# Altium schematic sheet TFT LCD ER-TFT018-2.SchDoc
size A4
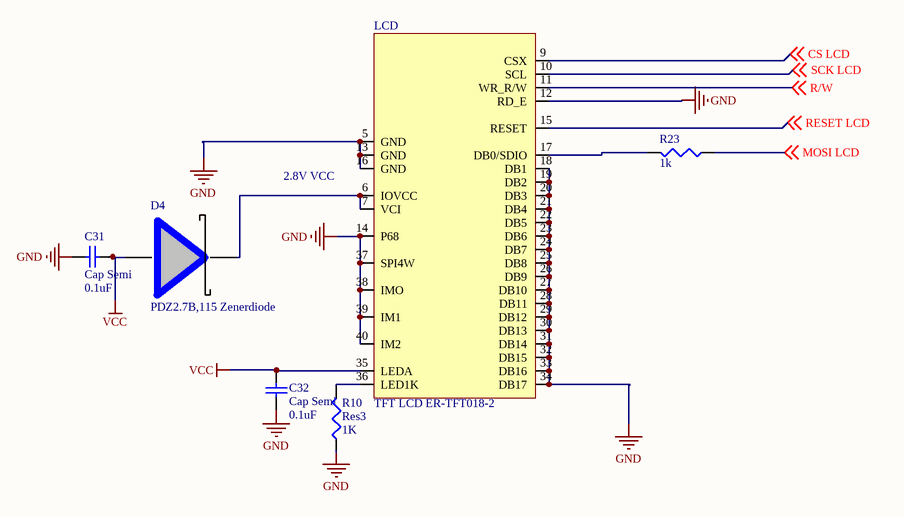
[diagram p0: TFT LCD ER-TFT018-2.SchDoc]

## Parts
C31  Cap Semi  value 0.1uF  [1608[0603]]
C32  Cap Semi  value 0.1uF  [1608[0603]]
D4  PDZ2.7B,115 Zenerdiode  [PDZ2.7B,115]
LCD  TFT LCD ER-TFT018-2  [LCD TFT Display]
R10  Res3  value 1K  [J1-0603]
R23  value 1k  [J1-0603]  (hidden comment: Res3)

## Nets
GND: C31.1 C32.1 LCD.5(GND) LCD.12(RD_E) LCD.13(GND) LCD.14(P68) LCD.16(GND) LCD.18(DB1) LCD.19(DB2) LCD.20(DB3) LCD.21(DB4) LCD.22(DB5) LCD.23(DB6) LCD.24(DB7) LCD.25(DB8) LCD.26(DB9) LCD.27(DB10) LCD.28(DB11) LCD.29(DB12) LCD.30(DB13) LCD.31(DB14) LCD.32(DB15) LCD.33(DB16) LCD.34(DB17) LCD.37(SPI4W) LCD.38(IMO) LCD.39(IM1) LCD.40(IM2) R10.1
VCC: C31.2 C32.2 D4.2 LCD.35(LEDA)
CS LCD: LCD.9(CSX) ; off-sheet CS LCD
MOSI LCD: R23.1 ; off-sheet MOSI LCD
R/W: LCD.11(WR_R/W) ; off-sheet R/W
RESET LCD: LCD.15(RESET) ; off-sheet RESET LCD
SCK LCD: LCD.10(SCL) ; off-sheet SCK LCD
NetD4_1: D4.1 LCD.6(IOVCC) LCD.7(VCI)
NetLCD_17: LCD.17(DB0/SDIO) R23.2
NetLCD_36: LCD.36(LED1K) R10.2

## Notes on the sheet
- (near LCD) 2.8V VCC

## Library data of the parts
C31 C32 = Cap Semi: Capacitor (Semiconductor SIM Model); Published: 8-Jun-2000; LatestRevisionDate: 29-May-2009; LatestRevisionNote: IPC-7351 Footprint Added.; PackageReference: C1206; Publisher: Altium Limited; PackageDescription: Chip Capacitor
R10 R23 = Res3: Resistor; Published: 8-Jun-2000; LatestRevisionDate: 29-May-2009; LatestRevisionNote: IPC-7351 Footprint Added.; PackageReference: J1-0603; Publisher: Altium Limited; PackageDescription: Chip Resistor